# EAGLE schematic automata (EAGLE 9.6.2)
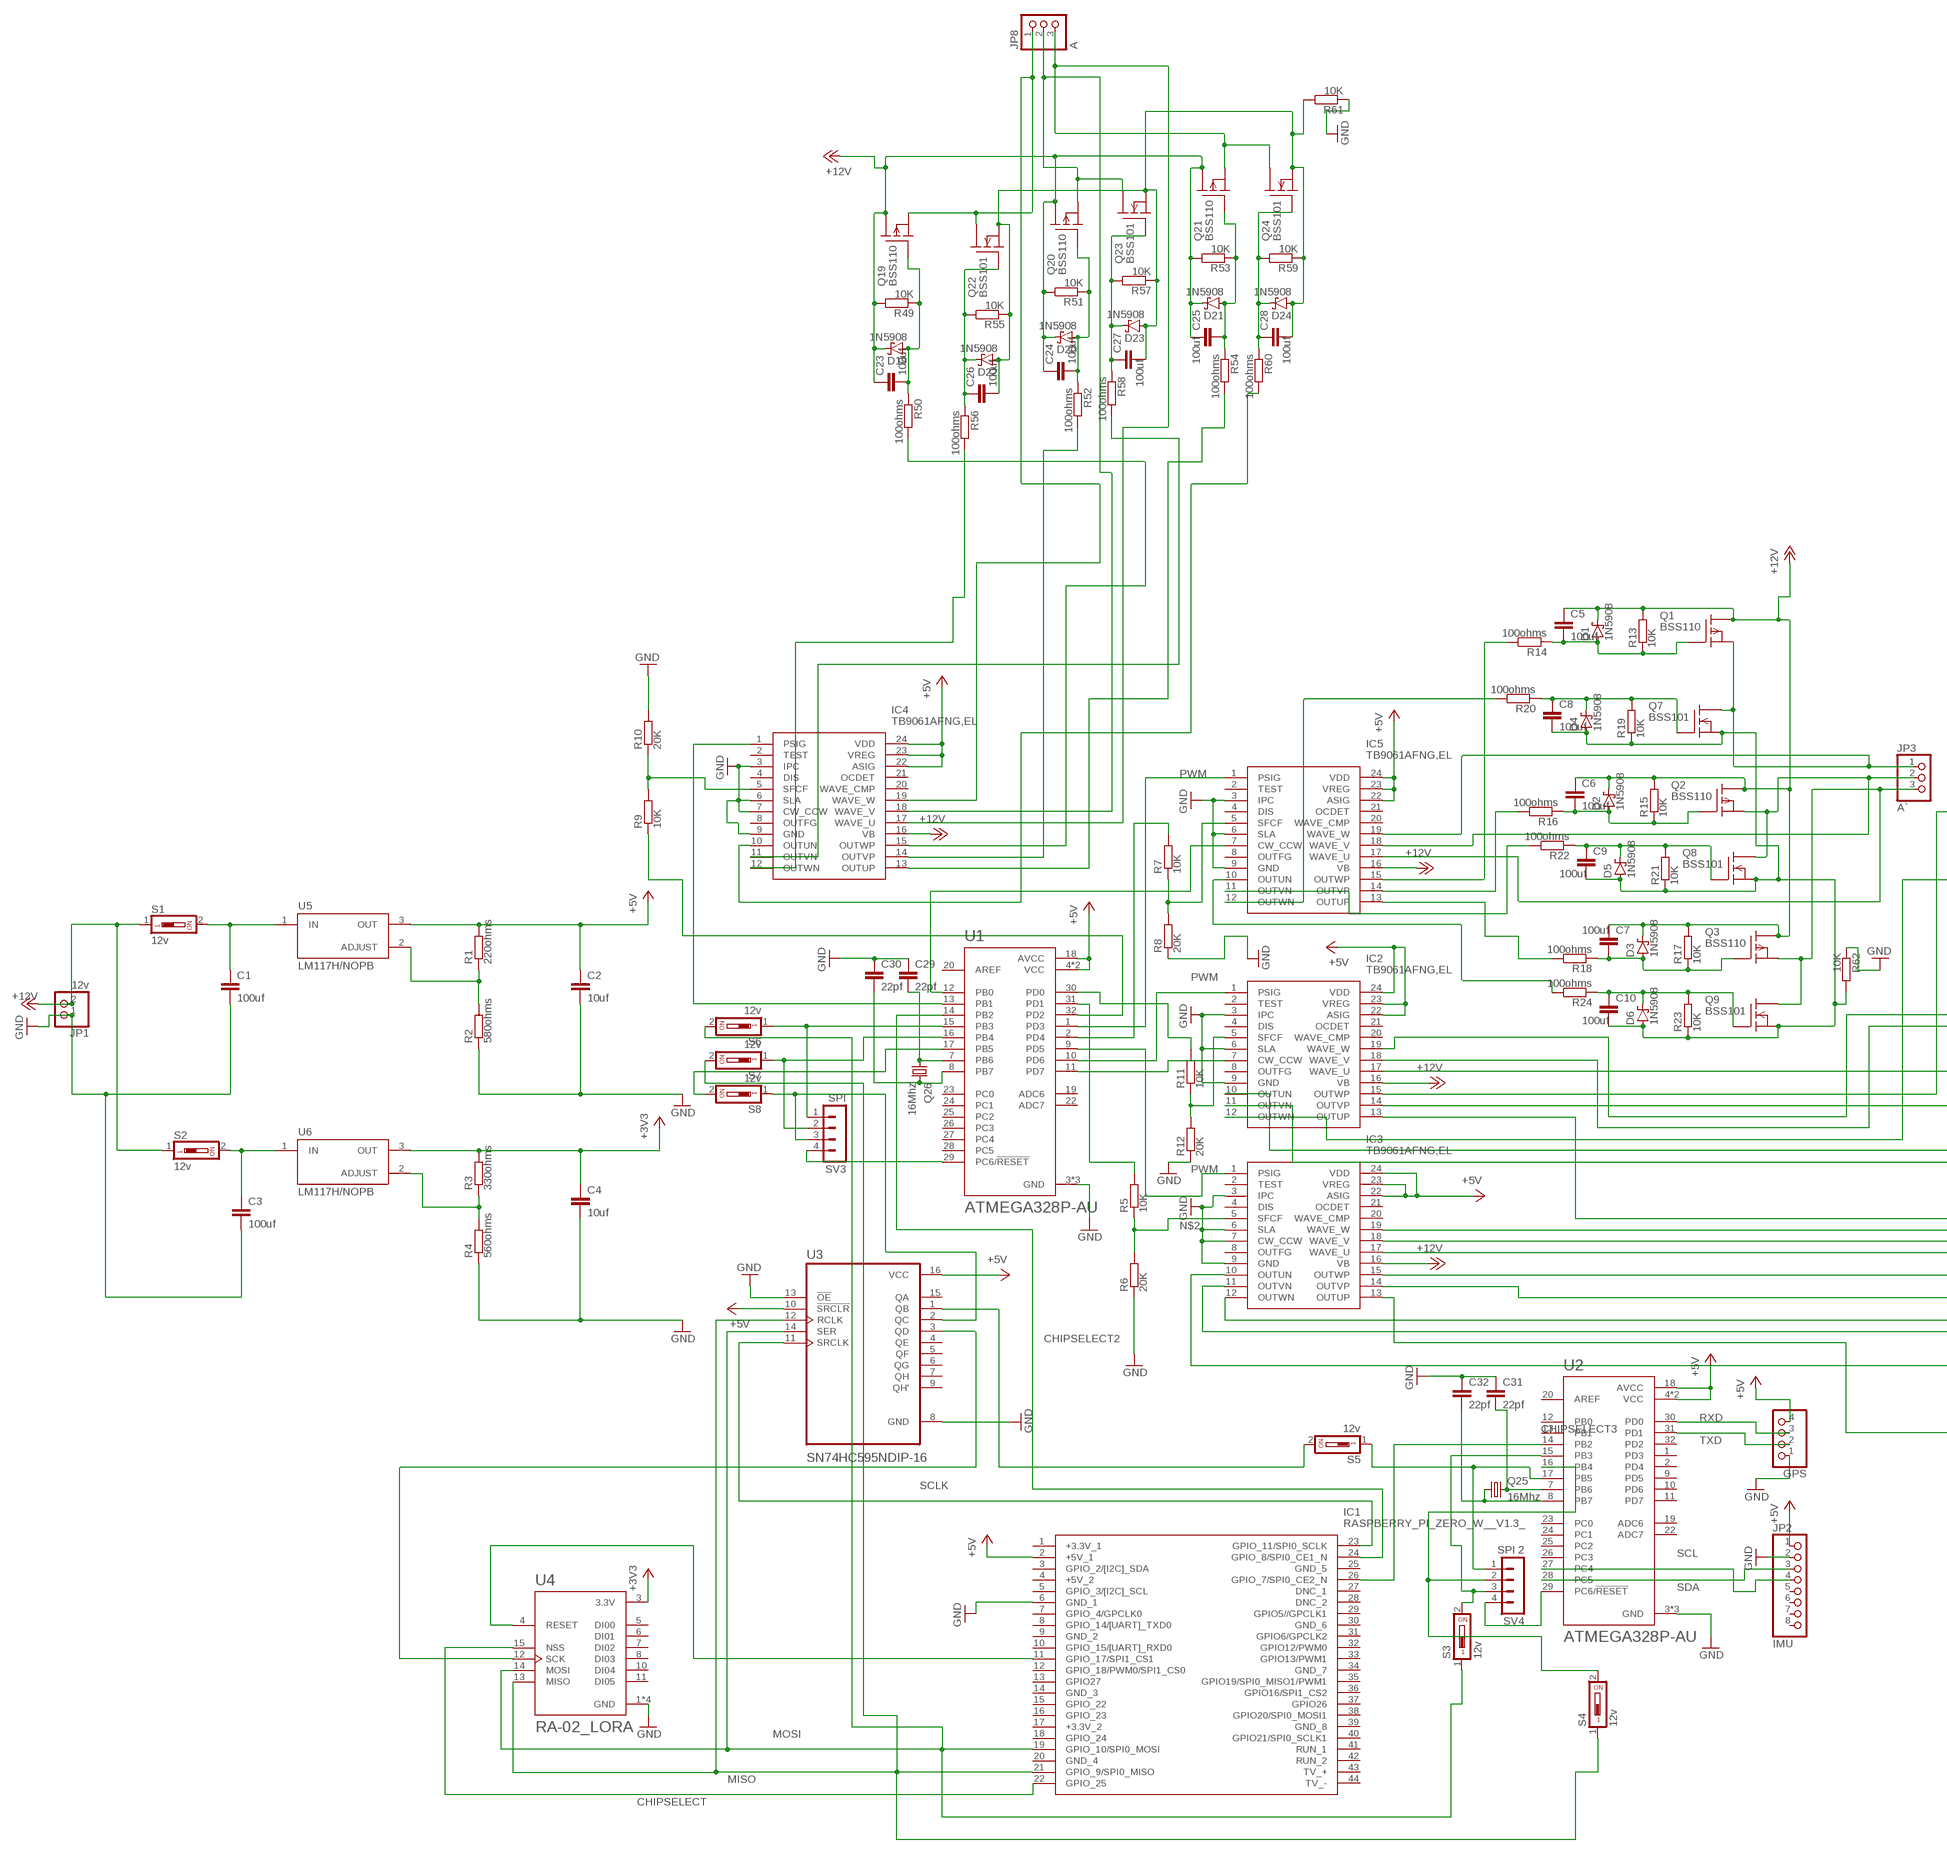
[diagram p0: schematic, sheet 1, part 1 of 2]
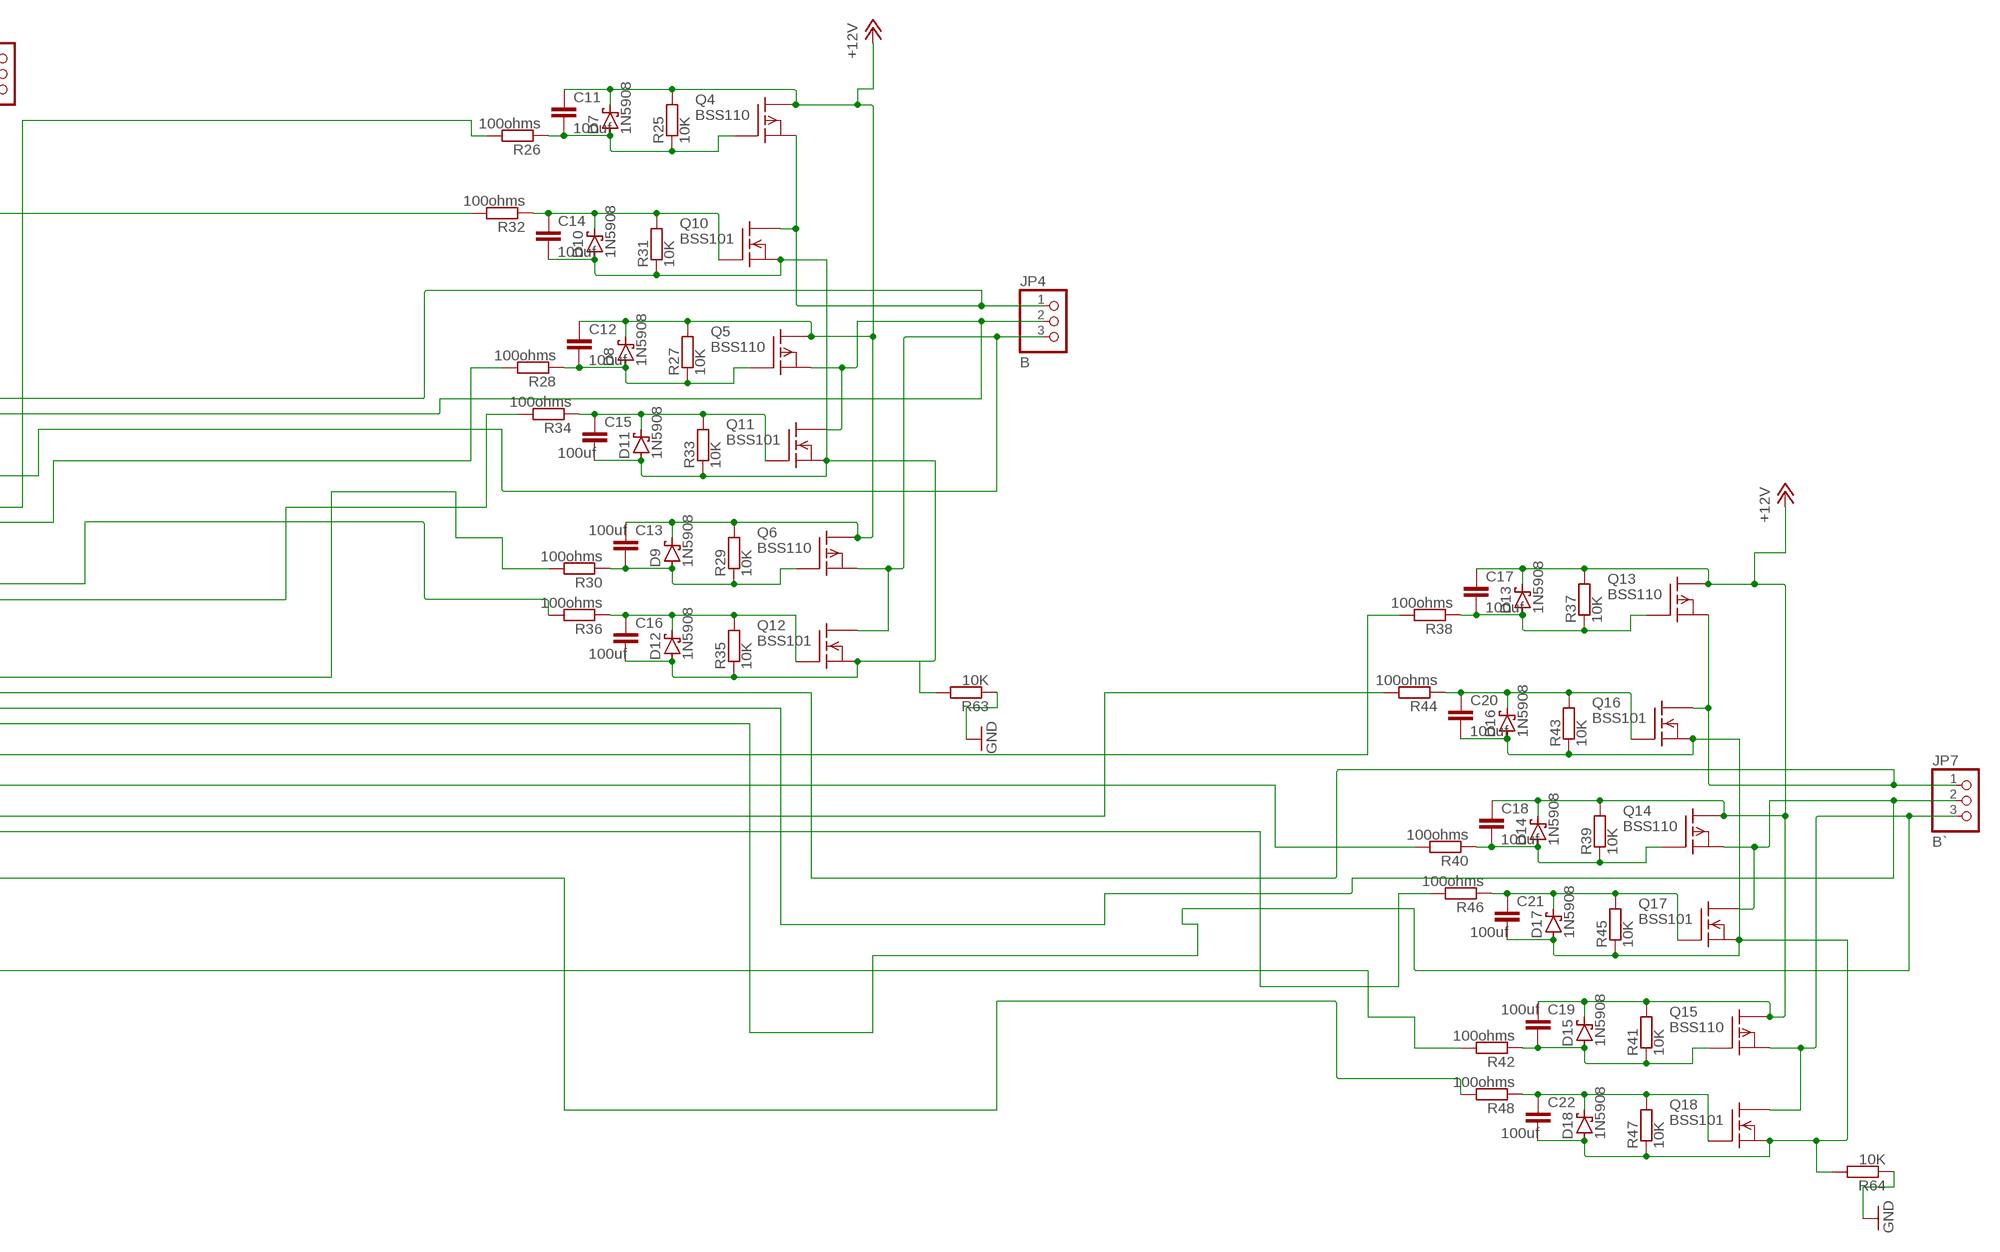
[diagram p1: schematic, sheet 1, part 2 of 2]

## Parts
C1  100uf  C-EUC0402K  [C0402K]
C2  10uf  C-EUC0402K  [C0402K]
C3  100uf  C-EUC0402K  [C0402K]
C4  10uf  C-EUC0402K  [C0402K]
C5  100uf  C-EUC0402K  [C0402K]
C6  100uf  C-EUC0402K  [C0402K]
C7  100uf  C-EUC0402K  [C0402K]
C8  100uf  C-EUC0402K  [C0402K]
C9  100uf  C-EUC0402K  [C0402K]
C10  100uf  C-EUC0402K  [C0402K]
C11  100uf  C-EUC0402K  [C0402K]
C12  100uf  C-EUC0402K  [C0402K]
C13  100uf  C-EUC0402K  [C0402K]
C14  100uf  C-EUC0402K  [C0402K]
C15  100uf  C-EUC0402K  [C0402K]
C16  100uf  C-EUC0402K  [C0402K]
C17  100uf  C-EUC0402K  [C0402K]
C18  100uf  C-EUC0402K  [C0402K]
C19  100uf  C-EUC0402K  [C0402K]
C20  100uf  C-EUC0402K  [C0402K]
C21  100uf  C-EUC0402K  [C0402K]
C22  100uf  C-EUC0402K  [C0402K]
C23  100uf  C-EUC0402K  [C0402K]
C24  100uf  C-EUC0402K  [C0402K]
C25  100uf  C-EUC0402K  [C0402K]
C26  100uf  C-EUC0402K  [C0402K]
C27  100uf  C-EUC0402K  [C0402K]
C28  100uf  C-EUC0402K  [C0402K]
C29  22pf  C-EUC0402K  [C0402K]
C30  22pf  C-EUC0402K  [C0402K]
C31  22pf  C-EUC0402K  [C0402K]
C32  22pf  C-EUC0402K  [C0402K]
D1  1N5908  [C4111-15]
D2  1N5908  [C4111-15]
D3  1N5908  [C4111-15]
D4  1N5908  [C4111-15]
D5  1N5908  [C4111-15]
D6  1N5908  [C4111-15]
D7  1N5908  [C4111-15]
D8  1N5908  [C4111-15]
D9  1N5908  [C4111-15]
D10  1N5908  [C4111-15]
D11  1N5908  [C4111-15]
D12  1N5908  [C4111-15]
D13  1N5908  [C4111-15]
D14  1N5908  [C4111-15]
D15  1N5908  [C4111-15]
D16  1N5908  [C4111-15]
D17  1N5908  [C4111-15]
D18  1N5908  [C4111-15]
D19  1N5908  [C4111-15]
D20  1N5908  [C4111-15]
D21  1N5908  [C4111-15]
D22  1N5908  [C4111-15]
D23  1N5908  [C4111-15]
D24  1N5908  [C4111-15]
GPS  PINHD-1X4  [1X04]
IC1  RASPBERRY_PI_ZERO_W__V1.3_  [RASPBERRYPIZEROWV13]
IC2  TB9061AFNG,EL  [SOP65P760X160-24N]
IC3  TB9061AFNG,EL  [SOP65P760X160-24N]
IC4  TB9061AFNG,EL  [SOP65P760X160-24N]
IC5  TB9061AFNG,EL  [SOP65P760X160-24N]
JP1  12v  PINHD-1X2  [1X02]
JP2  IMU  PINHD-1X8  [1X08]
JP3  A`  PINHD-1X3  [1X03]
JP4  B  PINHD-1X3  [1X03]
JP7  B`  PINHD-1X3  [1X03]
JP8  A  PINHD-1X3  [1X03]
Q1  BSS110  [TO92]
Q2  BSS110  [TO92]
Q3  BSS110  [TO92]
Q4  BSS110  [TO92]
Q5  BSS110  [TO92]
Q6  BSS110  [TO92]
Q7  BSS101  [TO92]
Q8  BSS101  [TO92]
Q9  BSS101  [TO92]
Q10  BSS101  [TO92]
Q11  BSS101  [TO92]
Q12  BSS101  [TO92]
Q13  BSS110  [TO92]
Q14  BSS110  [TO92]
Q15  BSS110  [TO92]
Q16  BSS101  [TO92]
Q17  BSS101  [TO92]
Q18  BSS101  [TO92]
Q19  BSS110  [TO92]
Q20  BSS110  [TO92]
Q21  BSS110  [TO92]
Q22  BSS101  [TO92]
Q23  BSS101  [TO92]
Q24  BSS101  [TO92]
Q25  16Mhz  CRYSTALHC49S  [HC49/S]
Q26  16Mhz  CRYSTALHC49S  [HC49/S]
R1  220ohms  SMK  [SMK]
R2  580ohms  SMK  [SMK]
R3  330ohms  SMK  [SMK]
R4  560ohms  SMK  [SMK]
R5  10K  SMK  [SMK]
R6  20K  SMK  [SMK]
R7  10K  SMK  [SMK]
R8  20K  SMK  [SMK]
R9  10K  SMK  [SMK]
R10  20K  SMK  [SMK]
R11  10K  SMK  [SMK]
R12  20K  SMK  [SMK]
R13  10K  SMK  [SMK]
R14  100ohms  SMK  [SMK]
R15  10K  SMK  [SMK]
R16  100ohms  SMK  [SMK]
R17  10K  SMK  [SMK]
R18  100ohms  SMK  [SMK]
R19  10K  SMK  [SMK]
R20  100ohms  SMK  [SMK]
R21  10K  SMK  [SMK]
R22  100ohms  SMK  [SMK]
R23  10K  SMK  [SMK]
R24  100ohms  SMK  [SMK]
R25  10K  SMK  [SMK]
R26  100ohms  SMK  [SMK]
R27  10K  SMK  [SMK]
R28  100ohms  SMK  [SMK]
R29  10K  SMK  [SMK]
R30  100ohms  SMK  [SMK]
R31  10K  SMK  [SMK]
R32  100ohms  SMK  [SMK]
R33  10K  SMK  [SMK]
R34  100ohms  SMK  [SMK]
R35  10K  SMK  [SMK]
R36  100ohms  SMK  [SMK]
R37  10K  SMK  [SMK]
R38  100ohms  SMK  [SMK]
R39  10K  SMK  [SMK]
R40  100ohms  SMK  [SMK]
R41  10K  SMK  [SMK]
R42  100ohms  SMK  [SMK]
R43  10K  SMK  [SMK]
R44  100ohms  SMK  [SMK]
R45  10K  SMK  [SMK]
R46  100ohms  SMK  [SMK]
R47  10K  SMK  [SMK]
R48  100ohms  SMK  [SMK]
R49  10K  SMK  [SMK]
R50  100ohms  SMK  [SMK]
R51  10K  SMK  [SMK]
R52  100ohms  SMK  [SMK]
R53  10K  SMK  [SMK]
R54  100ohms  SMK  [SMK]
R55  10K  SMK  [SMK]
R56  100ohms  SMK  [SMK]
R57  10K  SMK  [SMK]
R58  100ohms  SMK  [SMK]
R59  10K  SMK  [SMK]
R60  100ohms  SMK  [SMK]
R61  10K  SMK  [SMK]
R62  10K  SMK  [SMK]
R63  10K  SMK  [SMK]
R64  10K  SMK  [SMK]
S1  12v  DS01  [DS-01]
S2  12v  DS01  [DS-01]
S3  12v  DS01  [DS-01]
S4  12v  DS01  [DS-01]
S5  12v  DS01  [DS-01]
S6  12v  DS01  [DS-01]
S7  12v  DS01  [DS-01]
S8  12v  DS01  [DS-01]
SV3  SPI  MA04-1  [MA04-1]
SV4  SPI 2  MA04-1  [MA04-1]
U1  ATMEGA328P-AU  [QFP80P900X900X120-32N]
U2  ATMEGA328P-AU  [QFP80P900X900X120-32N]
U3  SN74HC595NDIP-16  [DIP794W45P254L1969H508Q16]
U4  RA-02_LORA  [MODULE_RA-02_LORA]
U5  LM117H/NOPB  [TO254P914H670-3]
U6  LM117H/NOPB  [TO254P914H670-3]

## Nets
+3V3: C4.1 R3.1 U4.3(3.3V) U6.3(OUT)
+5V: C2.1 GPS.4 IC1.2(+5V_1) IC2.22(ASIG) IC2.23(VREG) IC2.24(VDD) IC3.22(ASIG) IC3.23(VREG) IC3.24(VDD) IC4.22(ASIG) IC4.23(VREG) IC4.24(VDD) IC5.22(ASIG) IC5.23(VREG) IC5.24(VDD) JP2.1 R1.1 U1.4(VCC) U1.6(VCC) U1.18(AVCC) U2.4(VCC) U2.6(VCC) U2.18(AVCC) U3.10(!SRCLR) U3.16(VCC) U5.3(OUT)
+12V [12v]: C5.1 C6.1 C7.1 C11.1 C12.1 C13.1 C17.1 C18.1 C19.1 C23.1 C24.1 C25.1 D1.C D2.C D3.C D7.C D8.C D9.C D13.C D14.C D15.C D19.C D20.C D21.C IC2.16(VB) IC3.16(VB) IC4.16(VB) IC5.16(VB) JP1.2 Q1.3(D) Q2.3(D) Q3.3(D) Q4.3(D) Q5.3(D) Q6.3(D) Q13.3(D) Q14.3(D) Q15.3(D) Q19.3(D) Q20.3(D) Q21.3(D) R13.1 R15.1 R17.1 R25.1 R27.1 R29.1 R37.1 R39.1 R41.1 R49.1 R51.1 R53.1 S1.1 S2.1
CHIPSELECT: IC1.22(GPIO_25) U4.15(NSS)
CHIPSELECT2: IC1.24(GPIO_8/SPI0_CE1_N) U1.14(PB2)
CHIPSELECT3: IC1.26(GPIO_7/SPI0_CE2_N) U2.14(PB2)
GND [12v]: C1.2 C2.2 C3.2 C4.2 C29.1 C30.1 C31.1 C32.1 GPS.1 IC1.6(GND_1) IC2.3(IPC) IC2.6(SLA) IC2.9(GND) IC3.3(IPC) IC3.6(SLA) IC3.7(CW_CCW) IC3.9(GND) IC4.3(IPC) IC4.6(SLA) IC4.7(CW_CCW) IC4.9(GND) IC5.3(IPC) IC5.6(SLA) IC5.9(GND) JP1.1 JP2.2 R2.2 R4.2 R6.2 R8.2 R10.1 R12.2 R61.2 R62.2 R63.2 R64.2 U1.3(GND) U1.5(GND) U1.21(GND) U2.3(GND) U2.5(GND) U2.21(GND) U3.8(GND) U3.13(!OE) U4.1(GND) U4.2(GND) U4.9(GND) U4.16(GND)
MISO: IC1.21(GPIO_9/SPI0_MISO) S4.1 S7.2 U3.12(RCLK) U4.13(MISO)
MOSI: IC1.19(GPIO_10/SPI0_MOSI) S3.1 S6.2 U3.14(SER) U4.14(MOSI)
N$1: C1.1 S1.2 U5.1(IN)
N$2: IC3.5(SFCF) R5.2 R6.1
N$3: IC5.5(SFCF) R7.2 R8.1
N$4: IC3.1(PSIG) U1.9(PD5)
N$5: R1.2 R2.1 U5.2(ADJUST)
N$6: R5.1 U1.31(PD1)
N$7: C3.1 S2.2 U6.1(IN)
N$8: IC4.1(PSIG) U1.13(PB1)
N$9: R9.2 U1.32(PD2)
N$10: R7.1 U1.2(PD4)
N$11: R3.2 R4.1 U6.2(ADJUST)
N$12: IC5.1(PSIG) U1.1(PD3)
N$13: IC2.5(SFCF) R11.2 R12.1
N$14: IC4.5(SFCF) R9.1 R10.2
N$15: C5.2 D1.A Q1.2(G) R13.2 R14.2
N$16: U3.3(QD) U4.12(SCK)
N$17: S8.1 SV3.3 U3.2(QC)
N$18: S5.2 U3.1(QB)
N$19: IC2.7(CW_CCW) U1.11(PD7)
N$20: IC5.7(CW_CCW) U1.12(PB0)
N$21 [12v]: C26.2 C27.2 C28.2 D22.A D23.A D24.A Q22.1(S) Q23.1(S) Q24.1(S) R55.2 R57.2 R59.2 R61.1
N$22: IC5.15(OUTWP) R14.1
N$23: IC5.19(WAVE_W) JP3.1 Q1.1(S) Q7.3(D)
N$24: C6.2 D2.A Q2.2(G) R15.2 R16.2
N$25: C11.2 D7.A Q4.2(G) R25.2 R26.2
N$26: IC5.14(OUTVP) R16.1
N$27: C7.2 D3.A Q3.2(G) R17.2 R18.2
N$28 [12v]: C14.2 C15.2 C16.2 D10.A D11.A D12.A Q10.1(S) Q11.1(S) Q12.1(S) R31.2 R33.2 R35.2 R63.1
N$29: IC5.13(OUTUP) R18.1
N$30: IC5.18(WAVE_V) JP3.2 Q2.1(S) Q8.3(D)
N$31: C10.1 D6.C Q9.2(G) R23.1 R24.2
N$32: IC2.15(OUTWP) R26.1
N$33: C8.1 D4.C Q7.2(G) R19.1 R20.2
N$34: IC5.12(OUTWN) R20.1
N$35: IC2.19(WAVE_W) JP4.1 Q4.1(S) Q10.3(D)
N$36: C9.1 D5.C Q8.2(G) R21.1 R22.2
N$37: IC5.11(OUTVN) R22.1
N$38: C12.2 D8.A Q5.2(G) R27.2 R28.2
N$39: IC2.14(OUTVP) R28.1
N$40: IC5.10(OUTUN) R24.1
N$41: C29.2 Q26.1 U1.7(PB6)
N$42: C13.2 D9.A Q6.2(G) R29.2 R30.2
N$43: IC2.13(OUTUP) R30.1
N$44: IC5.17(WAVE_U) JP3.3 Q3.1(S) Q9.3(D)
N$45: IC2.18(WAVE_V) JP4.2 Q5.1(S) Q11.3(D)
N$46: C14.1 D10.C Q10.2(G) R31.1 R32.2
N$47: C15.1 D11.C Q11.2(G) R33.1 R34.2
N$48: IC2.11(OUTVN) R34.1
N$49: IC2.10(OUTUN) R36.1
N$50: C16.1 D12.C Q12.2(G) R35.1 R36.2
N$51: C30.2 Q26.2 U1.8(PB7)
N$52: IC3.12(OUTWN) R44.1
N$53: IC2.17(WAVE_U) JP4.3 Q6.1(S) Q12.3(D)
N$54: C17.2 D13.A Q13.2(G) R37.2 R38.2
N$55 [12v]: C8.2 C9.2 C10.2 D4.A D5.A D6.A Q7.1(S) Q8.1(S) Q9.1(S) R19.2 R21.2 R23.2 R62.1
N$56: IC3.15(OUTWP) R38.1
N$57: IC3.19(WAVE_W) JP7.1 Q13.1(S) Q16.3(D)
N$58: C18.2 D14.A Q14.2(G) R39.2 R40.2
N$59: IC3.14(OUTVP) R40.1
N$60: C19.2 D15.A Q15.2(G) R41.2 R42.2
N$61: IC3.11(OUTVN) R46.1
N$62: IC3.18(WAVE_V) JP7.2 Q14.1(S) Q17.3(D)
N$63: C20.1 D16.C Q16.2(G) R43.1 R44.2
N$64: C21.1 D17.C Q17.2(G) R45.1 R46.2
N$65: S5.1 SV4.1 U2.17(PB5)
N$66: IC3.10(OUTUN) R48.1
N$67: C22.1 D18.C Q18.2(G) R47.1 R48.2
N$68: SV3.4 U1.29(PC6/!RESET)
N$69: IC4.12(OUTWN) R56.1
N$70: IC3.17(WAVE_U) JP7.3 Q15.1(S) Q18.3(D)
N$71: C23.2 D19.A Q19.2(G) R49.2 R50.2
N$72 [12v]: C20.2 C21.2 C22.2 D16.A D17.A D18.A Q16.1(S) Q17.1(S) Q18.1(S) R43.2 R45.2 R47.2 R64.1
N$73: IC4.15(OUTWP) R50.1
N$74: IC4.19(WAVE_W) JP8.1 Q19.1(S) Q22.3(D)
N$75: C24.2 D20.A Q20.2(G) R51.2 R52.2
N$76: IC4.14(OUTVP) R52.1
N$77: C25.2 D21.A Q21.2(G) R53.2 R54.2
N$78: IC4.13(OUTUP) R54.1
N$79: IC4.18(WAVE_V) JP8.2 Q20.1(S) Q23.3(D)
N$80: C26.1 D22.C Q22.2(G) R55.1 R56.2
N$81: C27.1 D23.C Q23.2(G) R57.1 R58.2
N$82: IC4.11(OUTVN) R58.1
N$83: IC4.10(OUTUN) R60.1
N$84: C28.1 D24.C Q24.2(G) R59.1 R60.2
N$85: C31.2 Q25.2 U2.7(PB6)
N$86: C32.2 Q25.1 U2.8(PB7)
N$87: IC4.17(WAVE_U) JP8.3 Q21.1(S) Q24.3(D)
N$88: IC2.12(OUTWN) R32.1
N$89: S4.2 SV4.2 U2.16(PB4)
N$90: IC3.13(OUTUP) R42.1
N$91: S6.1 SV3.1 U1.15(PB3)
N$92: S7.1 SV3.2 U1.16(PB4)
N$93: S8.2 U1.17(PB5)
N$94: IC1.11(GPIO_17/SPI1_CS1) U4.4(RESET)
N$95: S3.2 SV4.3 U2.15(PB3)
N$96: SV4.4 U2.29(PC6/!RESET)
PWM: IC2.1(PSIG) U1.10(PD6)
RPM: R11.1 U1.30(PD0)
RXD: GPS.3 U2.30(PD0)
SCL: JP2.4 U2.27(PC4)
SCLK: IC1.23(GPIO_11/SPI0_SCLK) U3.11(SRCLK)
SDA: JP2.3 U2.28(PC5)
TXD: GPS.2 U2.31(PD1)
Unconnected: IC1.1(+3.3V_1) IC1.3(GPIO_2/[I2C]_SDA) IC1.4(+5V_2) IC1.5(GPIO_3/[I2C]_SCL) IC1.7(GPIO_4/GPCLK0) IC1.8(GPIO_14/[UART]_TXD0) IC1.9(GND_2) IC1.10(GPIO_15/[UART]_RXD0) IC1.12(GPIO_18/PWM0/SPI1_CS0) IC1.13(GPIO27) IC1.14(GND_3) IC1.15(GPIO_22) IC1.16(GPIO_23) IC1.17(+3.3V_2) IC1.18(GPIO_24) IC1.20(GND_4) IC1.25(GND_5) IC1.27(DNC_1) IC1.28(DNC_2) IC1.29(GPIO5//GPCLK1) IC1.30(GND_6) IC1.31(GPIO6/GPCLK2) IC1.32(GPIO12/PWM0) IC1.33(GPIO13/PWM1) IC1.34(GND_7) IC1.35(GPIO19/SPI0_MISO1/PWM1) IC1.36(GPIO16/SPI1_CS2) IC1.37(GPIO26) IC1.38(GPIO20/SPI0_MOSI1) IC1.39(GND_8) IC1.40(GPIO21/SPI0_SCLK1) IC1.41(RUN_1) IC1.42(RUN_2) IC1.43(TV_+) IC1.44(TV_-) IC2.2(TEST) IC2.4(DIS) IC2.8(OUTFG) IC2.20(WAVE_CMP) IC2.21(OCDET) IC3.2(TEST) IC3.4(DIS) IC3.8(OUTFG) IC3.20(WAVE_CMP) IC3.21(OCDET) IC4.2(TEST) IC4.4(DIS) IC4.8(OUTFG) IC4.20(WAVE_CMP) IC4.21(OCDET) IC5.2(TEST) IC5.4(DIS) IC5.8(OUTFG) IC5.20(WAVE_CMP) IC5.21(OCDET) JP2.5 JP2.6 JP2.7 JP2.8 U1.19(ADC6) U1.20(AREF) U1.22(ADC7) U1.23(PC0) U1.24(PC1) U1.25(PC2) U1.26(PC3) U1.27(PC4) U1.28(PC5) U2.1(PD3) U2.2(PD4) U2.9(PD5) U2.10(PD6) U2.11(PD7) U2.12(PB0) U2.13(PB1) U2.19(ADC6) U2.20(AREF) U2.22(ADC7) U2.23(PC0) U2.24(PC1) U2.25(PC2) U2.26(PC3) U2.32(PD2) U3.4(QE) U3.5(QF) U3.6(QG) U3.7(QH) U3.9(QH') U3.15(QA) U4.5(DI00) U4.6(DI01) U4.7(DI02) U4.8(DI03) U4.10(DI04) U4.11(DI05)

## Library data of the parts
C1-C32 = rcl:C-EU: CAPACITOR, European symbol; SPICEPREFIX: C
D1-D24 = diode:1N5908: DIODE schottky
GPS = pinhead:PINHD-1X4: PIN HEADER
IC1 = Raspberry_Pi_Zero_W__v1.3_:RASPBERRY_PI_ZERO_W__V1.3_: Raspberry Pi Zero W (v1.3) Single-board Computers Source: Datasheet <https://cdn.sparkfun.com/assets/learn_tutorials/6/7/6/PiZero_1.pdf>; DESCRIPTION: Raspberry Pi Zero W (v1.3) Single-board Computers; HEIGHT: mm; MANUFACTURER_NAME: RASPBERRY-PI; MANUFACTURER_PART_NUMBER: Raspberry Pi Zero W (v1.3)
IC2-IC5 = TB9061AFNG_EL:TB9061AFNG,EL: Motor / Motion / Ignition Controllers & Drivers 3Phase Motor PreDrvr Automotive; AEC-Q100 Source: Datasheet <https://datasheet.datasheetarchive.com/originals/distributors/Datasheets_SAMA/2e224b8eff99c5a559bb7338490d6a78.pdf>; DESCRIPTION: Motor / Motion / Ignition Controllers & Drivers 3Phase Motor PreDrvr Automotive; AEC-Q100; HEIGHT: 1.6mm; MANUFACTURER_NAME: Toshiba; MANUFACTURER_PART_NUMBER: TB9061AFNG,EL; MOUSER_PART_NUMBER: 757-TB9061AFNG,EL; MOUSER_PRICE-STOCK: https://www.mouser.co.uk/ProductDetail/Toshiba/TB9061AFNGEL?qs=Zz7%252BYVVL6bFPI%2FJC2kcjdw%3D%3D
JP1 = pinhead:PINHD-1X2: PIN HEADER
JP2 = pinhead:PINHD-1X8: PIN HEADER
JP3 JP4 JP7 JP8 = pinhead:PINHD-1X3: PIN HEADER
Q1-Q6 Q13-Q15 Q19-Q21 = transistor-fet:BSS110: P-Channel Enhancement MOSFET -50V; -0,17A; 6Ohm
Q7-Q12 Q16-Q18 Q22-Q24 = transistor-fet:BSS101: N-Channel Enhancement MOSFET 200V; 0,16A; 11Ohm
Q25 Q26 = crystal:CRYSTAL: CRYSTAL; OC_FARNELL: 1667008; OC_NEWARK: unknown
R1-R64 = resistor-shunt:SMK: SMD SHUNT RESISTOR; OC_FARNELL: unknown; OC_NEWARK: unknown
S1-S8 = switch-dil:DS01: DIL/CODE SWITCH; OC_FARNELL: unknown; OC_NEWARK: unknown
SV3 SV4 = con-lstb:MA04-1: PIN HEADER; OC_FARNELL: unknown; OC_NEWARK: unknown
U1 U2 = ATMEGA328P-AU:ATMEGA328P-AU: ATmega Series 20 MHz 32 KB Flash 2 KB SRAM 8-Bit Microcontroller - TQFP-32 Check availability <https://pricing.snapeda.com/parts/ATMEGA328P-AU/Microchip%20Technology/view-part?ref=eda>; AVAILABILITY: In Stock; DESCRIPTION: AVR AVR® ATmega Microcontroller IC 8-Bit 20MHz 32KB (16K x 16) FLASH 32-TQFP (7x7); MF: Microchip Technology; MP: ATMEGA328P-AU; PACKAGE: TQFP-32 Microchip; PRICE: None; PURCHASE-URL: https://pricing.snapeda.com/search/part/ATMEGA328P-AU/?ref=eda
U3 = SN74HC595N:SN74HC595N: Check availability <https://pricing.snapeda.com/parts/SN74HC595N/Texas%20Instruments/view-part?ref=eda>; AVAILABILITY: In Stock; DESCRIPTION: 8-bit shift registers with 3-state output registers; MF: Texas Instruments; MP: SN74HC595N; PACKAGE: PDIP-16 Texas Instruments; PRICE: None; PURCHASE-URL: https://pricing.snapeda.com/search/part/SN74HC595N/?ref=eda
U4 = RA-02_LORA:RA-02_LORA: Ra-02 LoRa RF M5Stack Platform Evaluation Expansion Board Check availability <https://pricing.snapeda.com/parts/Ra-02%20LoRa/AI-Thinker/view-part?ref=eda>; AVAILABILITY: In Stock; DESCRIPTION: Ra-02 LoRa RF M5Stack Platform Evaluation Expansion Board; MF: AI-Thinker; MP: Ra-02 LoRa; PACKAGE: None; PRICE: None; PURCHASE-URL: https://pricing.snapeda.com/search/part/Ra-02 LoRa/?ref=eda
U5 U6 = LM117H_NOPB:LM117H/NOPB: Linear Voltage Regulator IC 1 Output 1.5A TO-39-3 Check availability <https://pricing.snapeda.com/parts/LM117H/NOPB/Texas%20Instruments/view-part?ref=eda>; AVAILABILITY: In Stock; DESCRIPTION: Extended Temperature 1.5A Adjustable Linear Regulator with Short Circuit Protection; MF: Texas Instruments; MP: LM117H/NOPB; PACKAGE: TO-CAN-3 Texas Instruments; PRICE: None; PURCHASE-URL: https://pricing.snapeda.com/search/part/LM117H/NOPB/?ref=eda

## Net classes
0 default: width 0.254 mm, drill 0.254 mm, clearance 0.127 mm
1 12v: width 0.381 mm, drill 0.254 mm, clearance 0.127 mm